# Altium schematic sheet CSA.SchDoc
size 203 x 152 mm
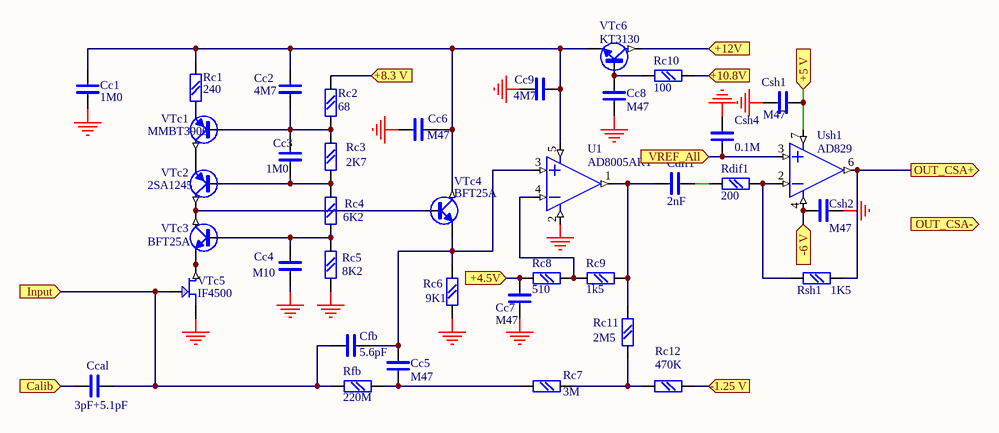
[diagram p0: CSA.SchDoc]

## Parts
Cc1  1M0  [chip0805]
Cc2  4M7  [chip0805]
Cc3  1M0  [chip0805]
Cc4  M10  [chip0805]
Cc5  M47  [chip0805]
Cc6  M47  [chip0805]
Cc7  M47  [chip0805]
Cc8  M47  [chip0805]
Cc9  4M7  [chip1206]
Ccal  3pF+5.1pF  [chip0805]
Cdif1  2nF  [chip0805]
Cfb  5.6pF  [chip0805]
Csh1  M47  [chip0805]
Csh2  M47  [chip0805]
Csh4  0.1M  [chip0805]
Rc1  240  [chip0805]
Rc2  68  [chip0805]
Rc3  2K7  [chip0805]
Rc4  6K2  [chip0805]
Rc5  8K2  [chip0805]
Rc6  9K1  [chip0805]
Rc7  3M  [chip0805]
Rc8  510  [chip0805]
Rc9  1k5  [chip0805]
Rc10  100  [chip0805]
Rc11  2M5  [chip0805]
Rc12  470K  [chip0805]
Rdif1  200  [chip0805]
Rfb  220M  [chip1206]
Rsh1  1K5  [chip0805]
U1  AD8005ART  [SOT23-5]
Ush1  AD829  [8SO200]
VTc1  MMBT3906  [SOT23_bt]
VTc2  2SA1245  [SOT23_bt]
VTc3  BFT25A  [SOT23_bt]
VTc4  BFT25A  [SOT23_bt]
VTc5  IF4500  [SOT23_Fet]
VTc6  KT3130  [SOT23_bt]

## Ports
+4.5V (in), +5 V (in), +8.3 V (in), +10.8V (in), +12V (in), -1.25 V (in), -6 V (in), Calib (in), Input (in), OUT_CSA+ (out), OUT_CSA- (out), VREF_All (in)

## Nets
GND: Cc1.1 Cc4.2 Cc6.1 Cc7.2 Cc8.2 Cc9.1 Csh1.2 Csh2.1 Csh4.1 Rc5.1 Rc6.2 U1.2(E-) VTc5.SOUR
+4.5V: Cc7.1 Rc8.1 ; port +4.5V
+5 V: Csh1.1 Ush1.7(E+) ; port +5 V
+8.3 V: Rc2.2 ; port +8.3 V
+10.8V: Rc10.2 ; port +10.8V
+12V: VTc6.COLL ; port +12V
-1.25 V: Rc12.2 ; port -1.25 V
-6 V: Csh2.2 Ush1.4(E-) ; port -6 V
Calib: Ccal.1 ; port Calib
Input: Ccal.2 Cfb.1 Rfb.1 VTc5.GATE ; port Input
OUT_CSA+: Rsh1.2 Ush1.6(OUT) ; port OUT_CSA+
VREF_All: Csh4.2 Ush1.3(+IN) ; port VREF_All
NetCc1_2: Cc1.2 Cc2.1 Cc6.2 Cc9.2 Rc1.1 U1.5(E+) VTc4.COLL VTc6.EMIT
NetCc2_2: Cc2.2 Cc3.1 Rc2.1 Rc3.1 VTc1.BASE
NetCc3_2: Cc3.2 Rc3.2 Rc4.1 VTc2.BASE
NetCc4_1: Cc4.1 Rc4.2 Rc5.2 VTc3.BASE
NetCc5_1: Cc5.1 Cfb.2 Rc6.1 U1.3(+IN) VTc4.EMIT
NetCc5_2: Cc5.2 Rc7.2 Rfb.2
NetCc8_1: Cc8.1 Rc10.1 VTc6.BASE
NetCdif1_1: Cdif1.1 Rc9.2 Rc11.2 U1.1(OUT)
NetCdif1_2: Cdif1.2 Rdif1.1
NetRc1_2: Rc1.2 VTc1.EMIT
NetRc7_1: Rc7.1 Rc11.1 Rc12.1
NetRc8_2: Rc8.2 Rc9.1 U1.4(-IN)
NetRdif1_2: Rdif1.2 Rsh1.1 Ush1.2(-IN)
NetVTc1_COLL: VTc1.COLL VTc2.EMIT
NetVTc2_COLL: VTc2.COLL VTc3.COLL VTc4.BASE
NetVTc3_EMIT: VTc3.EMIT VTc5.DRAI

## Library data of the parts
Cc1-Cc9 Ccal Cdif1 Cfb Csh1 Csh2 Csh4 = C: Text Field1: 20; Text Field2: 10
Rc1-Rc12 Rfb = MLT: Text Field1: 20; Text Field2: 20
Rdif1 Rsh1 = R: Text Field1: 20; Text Field2: 20
U1 = AD8005ART: Text Field1: 40; Text Field2: 40
Ush1 = AD8005: Text Field1: 40; Text Field2: 40
VTc1 VTc2 = $PNP: Text Field1: 10; Text Field2: 20
VTc3 VTc4 VTc6 = $NPN: Text Field1: 10; Text Field2: 20
VTc5 = $JFET N: Text Field1: 10; Text Field2: 20